# Altium schematic sheet connectors.SchDoc: Connectors
size A4; Organization: Badgerloop Electrical; Address1: 133 Engineering Research Building; Address2: 1500 Engineering Drive; Address3: Madison, Wi 53706
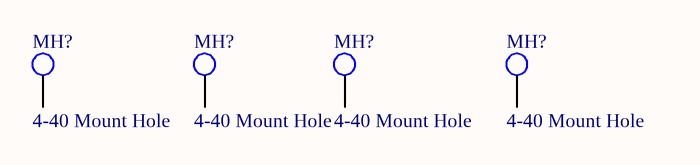
[diagram p0: connectors.SchDoc]

## Parts
(Parts that share a designator on the sheet are numbered #1, #2 ... from top to bottom, then left to right.)
MH?#1  4-40 Mount Hole  [MH]
MH?#2  4-40 Mount Hole  [MH]
MH?#3  4-40 Mount Hole  [MH]
MH?#4  4-40 Mount Hole  [MH]

## Nets

Not connected (* = marked no-connect by the designer): MH?#1 46; MH?#2 46; MH?#3 46; MH?#4 46

## Notes on the sheet
- Title
- Engineer:
- Date:
- Time:
- Revision:
- Sheet
- of
- File: